# Altium schematic sheet WINGS_SIGNAL_SCH.SchDoc
size C; SheetNumber: 1; SheetTotal: 1
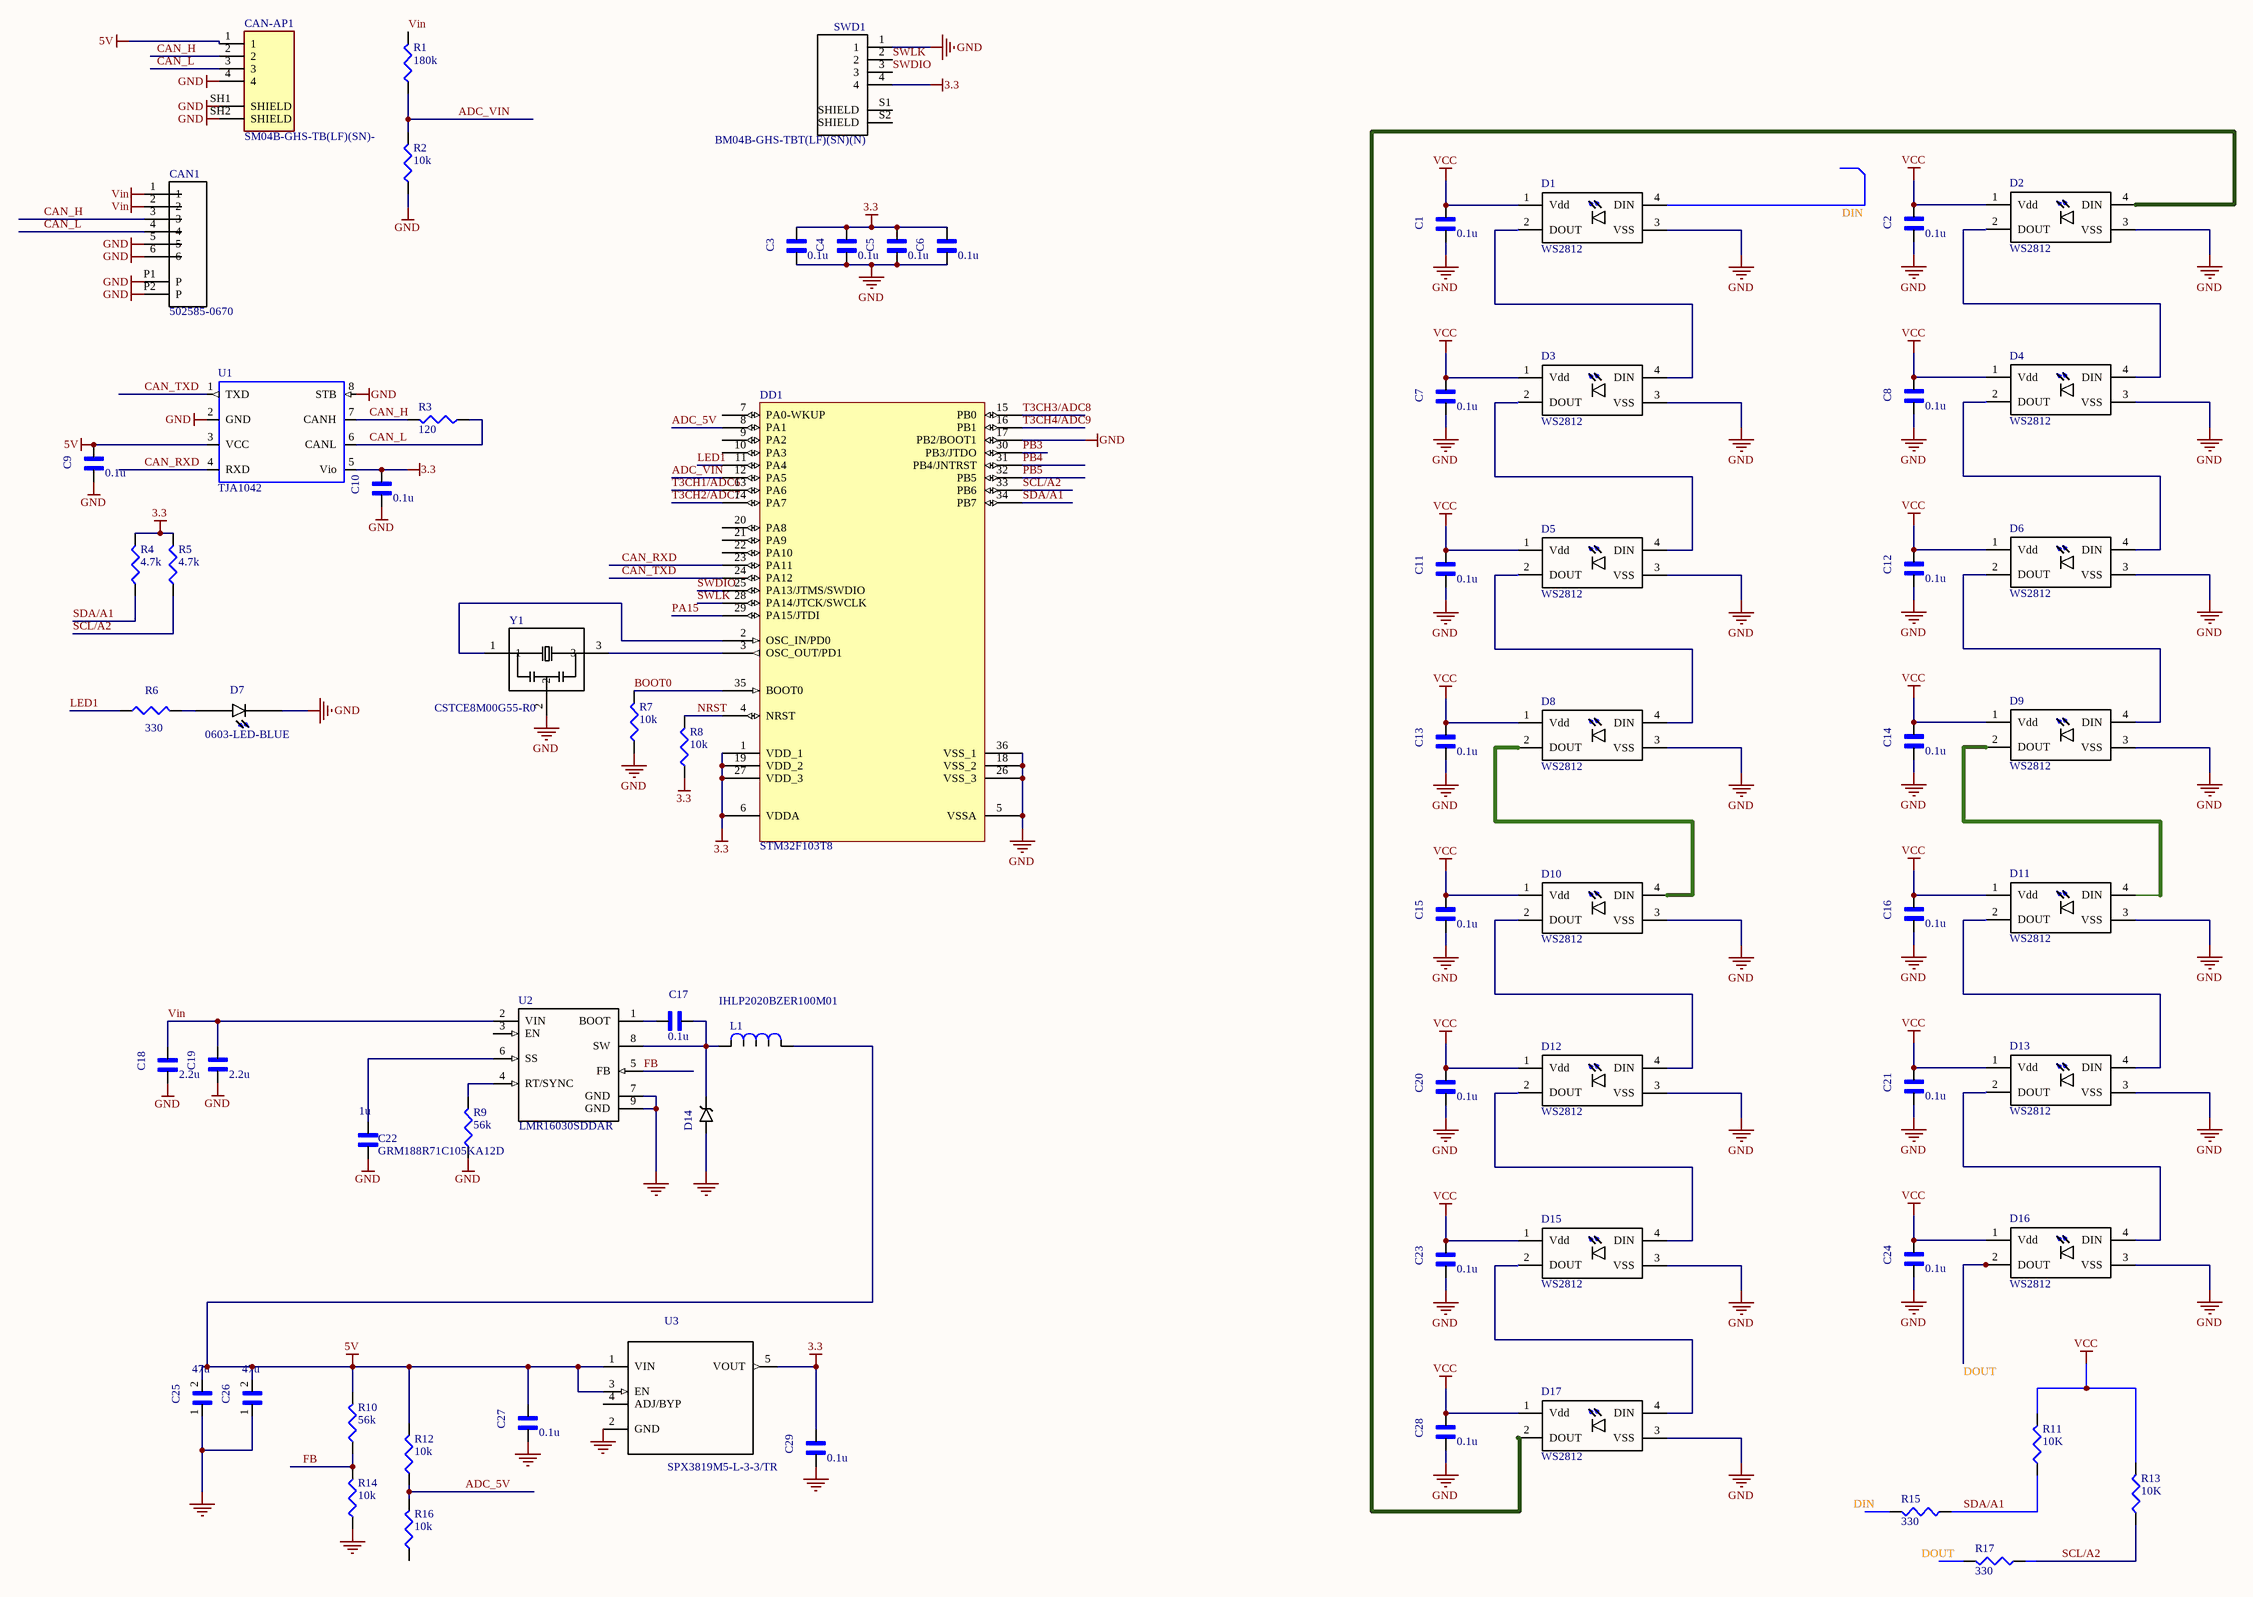
[diagram p0: WINGS_SIGNAL_SCH.SchDoc]

## Parts
C1  value 0.1u  [*CAPC1608X90]  (hidden comment: GX035C104MAT2-500)
C2  value 0.1u  [*CAPC1608X90]  (hidden comment: GX035C104MAT2-500)
C3  value 0.1u  [*CAPC1608X90]  (hidden comment: GX035C104MAT2-500)
C4  value 0.1u  [*CAPC1608X90]  (hidden comment: GX035C104MAT2-500)
C5  value 0.1u  [*CAPC1608X90]  (hidden comment: GX035C104MAT2-500)
C6  value 0.1u  [*CAPC1608X90]  (hidden comment: GX035C104MAT2-500)
C7  value 0.1u  [*CAPC1608X90]  (hidden comment: GX035C104MAT2-500)
C8  value 0.1u  [*CAPC1608X90]  (hidden comment: GX035C104MAT2-500)
C9  value 0.1u  [*CAPC1608X90]  (hidden comment: GX035C104MAT2-500)
C10  value 0.1u  [*CAPC1608X90]  (hidden comment: GX035C104MAT2-500)
C11  value 0.1u  [*CAPC1608X90]  (hidden comment: GX035C104MAT2-500)
C12  value 0.1u  [*CAPC1608X90]  (hidden comment: GX035C104MAT2-500)
C13  value 0.1u  [*CAPC1608X90]  (hidden comment: GX035C104MAT2-500)
C14  value 0.1u  [*CAPC1608X90]  (hidden comment: GX035C104MAT2-500)
C15  value 0.1u  [*CAPC1608X90]  (hidden comment: GX035C104MAT2-500)
C16  value 0.1u  [*CAPC1608X90]  (hidden comment: GX035C104MAT2-500)
C17  value 0.1u  [*CAPC1608X90]  (hidden comment: GX035C104MAT2-500)
C18  value 2.2u  [*CAP3216X125N]  (hidden comment: GRM31CR71H225KA88L)
C19  value 2.2u  [*CAP3216X125N]  (hidden comment: GRM31CR71H225KA88L)
C20  value 0.1u  [*CAPC1608X90]  (hidden comment: GX035C104MAT2-500)
C21  value 0.1u  [*CAPC1608X90]  (hidden comment: GX035C104MAT2-500)
C22  GRM188R71C105KA12D  value 1u  [CAPC1608X90N]
C23  value 0.1u  [*CAPC1608X90]  (hidden comment: GX035C104MAT2-500)
C24  value 0.1u  [*CAPC1608X90]  (hidden comment: GX035C104MAT2-500)
C25  value 47u  [*CAPC3216X125N]  (hidden comment: GRM31CR61A476KE15L)
C26  value 47u  [*CAPC3216X125N]  (hidden comment: GRM31CR61A476KE15L)
C27  value 0.1u  [*CAPC1608X90]  (hidden comment: GX035C104MAT2-500)
C28  value 0.1u  [*CAPC1608X90]  (hidden comment: GX035C104MAT2-500)
C29  value 0.1u  [*CAPC1608X90]  (hidden comment: GX035C104MAT2-500)
CAN1  502585-0670  [MOLEX_502585-0670]
CAN-AP1  SM04B-GHS-TB(LF)(SN)-  [JST_SM04B-GHS-TB(LF)(SN)-]
D1  WS2812  [LED_WS2812]
D2  WS2812  [LED_WS2812]
D3  WS2812  [LED_WS2812]
D4  WS2812  [LED_WS2812]
D5  WS2812  [LED_WS2812]
D6  WS2812  [LED_WS2812]
D7  0603-LED-BLUE  [*LEDM1608X80_LTE-C1906R-14(Primary)]
D8  WS2812  [LED_WS2812]
D9  WS2812  [LED_WS2812]
D10  WS2812  [LED_WS2812]
D11  WS2812  [LED_WS2812]
D12  WS2812  [LED_WS2812]
D13  WS2812  [LED_WS2812]
D14  SK56  [*SMB_P6SMB62AT3G(Primary)]  (value not drawn)
D15  WS2812  [LED_WS2812]
D16  WS2812  [LED_WS2812]
D17  WS2812  [LED_WS2812]
DD1  STM32F103T8  [*QFN50P600X600X100-37N]
L1  IHLP2020BZER100M01  [IHLP]
R1  value 180k  [J1-0603]  (hidden comment: Res3)
R2  value 10k  [J1-0603]  (hidden comment: Res3)
R3  value 120  [J1-0603]  (hidden comment: Res3)
R4  value 4.7k  [J1-0603]  (hidden comment: Res3)
R5  value 4.7k  [J1-0603]  (hidden comment: Res3)
R6  value 330  [J1-0603]  (hidden comment: Res3)
R7  value 10k  [J1-0603]  (hidden comment: RC0603FR-0710KL)
R8  value 10k  [J1-0603]  (hidden comment: RC0603FR-0710KL)
R9  value 56k  [J1-0603]  (hidden comment: Res3)
R10  value 56k  [J1-0603]  (hidden comment: Res3)
R11  value 10K  [J1-0603]  (hidden comment: Res3)
R12  value 10k  [J1-0603]  (hidden comment: RC0603FR-0710KL)
R13  value 10K  [J1-0603]  (hidden comment: Res3)
R14  value 10k  [J1-0603]  (hidden comment: RC0603FR-0710KL)
R15  value 330  [J1-0603]  (hidden comment: Res3)
R16  value 10k  [J1-0603]  (hidden comment: RC0603FR-0710KL)
R17  value 330  [J1-0603]  (hidden comment: Res3)
SWD1  BM04B-GHS-TBT(LF)(SN)(N)  [JST_BM04B-GHS-holes]
U1  TJA1042  [SOT782-1]
U2  LMR16030SDDAR  [*SOIC127P600X170-9N - duplicate]
U3  SPX3819M5-L-3-3/TR  [*SOT95P280X145-5N]
Y1  CSTCE8M00G55-R0  [*OSC_CSTCE8M00G55-R0]

## Nets
3.3: C3.1 C4.1 C5.1 C6.1 C10.1 C29.1 DD1.1(VDD_1) DD1.6(VDDA) DD1.19(VDD_2) DD1.27(VDD_3) R4.2 R5.2 R8.1 SWD1.4 U1.5(Vio) U3.5(VOUT)
5V: C9.1 C25.2 C26.2 C27.1 CAN-AP1.1 L1.1 R10.2 R12.2 U1.3(VCC) U3.1(VIN) U3.3(EN)
GND: C1.2 C2.2 C3.2 C4.2 C5.2 C6.2 C7.2 C8.2 C9.2 C10.2 C11.2 C12.2 C13.2 C14.2 C15.2 C16.2 C18.2 C19.2 C20.2 C21.2 C22.1 C23.2 C24.2 C25.1 C26.1 C27.2 C28.2 C29.2 CAN1.5 CAN1.6 CAN1.P1(P) CAN1.P2(P) CAN-AP1.4 CAN-AP1.SH1(SHIELD) CAN-AP1.SH2(SHIELD) D1.3(VSS) D2.3(VSS) D3.3(VSS) D4.3(VSS) D5.3(VSS) D6.3(VSS) D7.C D8.3(VSS) D9.3(VSS) D10.3(VSS) D11.3(VSS) D12.3(VSS) D13.3(VSS) D14.A D15.3(VSS) D16.3(VSS) D17.3(VSS) DD1.5(VSSA) DD1.17(PB2/BOOT1) DD1.18(VSS_2) DD1.26(VSS_3) DD1.36(VSS_1) R2.1 R7.1 R9.1 R14.1 SWD1.1 U1.2(GND) U1.8(STB) U2.7(GND) U2.9(GND) U3.2(GND) Y1.2
VCC: C1.1 C2.1 C7.1 C8.1 C11.1 C12.1 C13.1 C14.1 C15.1 C16.1 C20.1 C21.1 C23.1 C24.1 C28.1 D1.1(Vdd) D2.1(Vdd) D3.1(Vdd) D4.1(Vdd) D5.1(Vdd) D6.1(Vdd) D8.1(Vdd) D9.1(Vdd) D10.1(Vdd) D11.1(Vdd) D12.1(Vdd) D13.1(Vdd) D15.1(Vdd) D16.1(Vdd) D17.1(Vdd) R11.2 R13.2
Vin: C18.1 C19.1 CAN1.1 CAN1.2 R1.2 U2.2(VIN)
ADC_5V: DD1.8(PA1) R12.1 R16.2
ADC_VIN: DD1.12(PA5) R1.1 R2.2
BOOT0: DD1.35(BOOT0) R7.2
CAN_H: CAN1.3 CAN-AP1.2 R3.2 U1.7(CANH)
CAN_L: CAN1.4 CAN-AP1.3 R3.1 U1.6(CANL)
CAN_RXD: DD1.23(PA11) U1.4(RXD)
CAN_TXD: DD1.24(PA12) U1.1(TXD)
DIN: D1.4(DIN) R15.2
DOUT: D16.2(DOUT) R17.2
FB: R10.1 R14.2 U2.5(FB)
LED1: DD1.11(PA4) R6.1
NRST: DD1.4(NRST) R8.2
PA15: DD1.29(PA15/JTDI)
PB3: DD1.30(PB3/JTDO)
PB4: DD1.31(PB4/JNTRST)
PB5: DD1.32(PB5)
SCL/A2: DD1.33(PB6) R5.1 R13.1 R17.1
SDA/A1: DD1.34(PB7) R4.1 R11.1 R15.1
SWDIO: DD1.25(PA13/JTMS/SWDIO) SWD1.3
SWLK: DD1.28(PA14/JTCK/SWCLK) SWD1.2
T3CH1/ADC6: DD1.13(PA6)
T3CH2/ADC7: DD1.14(PA7)
T3CH3/ADC8: DD1.15(PB0)
T3CH4/ADC9: DD1.16(PB1)
NetC17_1: C17.1 D14.C L1.2 U2.8(SW)
NetC17_2: C17.2 U2.1(BOOT)
NetC22_2: C22.2 U2.6(SS)
NetD1_2: D1.2(DOUT) D3.4(DIN)
NetD2_2: D2.2(DOUT) D4.4(DIN)
NetD2_4: D2.4(DIN) D17.2(DOUT)
NetD3_2: D3.2(DOUT) D5.4(DIN)
NetD4_2: D4.2(DOUT) D6.4(DIN)
NetD5_2: D5.2(DOUT) D8.4(DIN)
NetD6_2: D6.2(DOUT) D9.4(DIN)
NetD7_A: D7.A R6.2
NetD8_2: D8.2(DOUT) D10.4(DIN)
NetD9_2: D9.2(DOUT) D11.4(DIN)
NetD10_2: D10.2(DOUT) D12.4(DIN)
NetD11_2: D11.2(DOUT) D13.4(DIN)
NetD12_2: D12.2(DOUT) D15.4(DIN)
NetD13_2: D13.2(DOUT) D16.4(DIN)
NetD15_2: D15.2(DOUT) D17.4(DIN)
NetDD1_2: DD1.2(OSC_IN/PD0) Y1.1
NetDD1_3: DD1.3(OSC_OUT/PD1) Y1.3
NetR9_2: R9.2 U2.4(RT/SYNC)

Not connected (* = marked no-connect by the designer): DD1 7(PA0-WKUP) 9(PA2) 10(PA3) 20(PA8) 21(PA9) 22(PA10); R16 1; SWD1 S1(SHIELD) S2(SHIELD); U2 3(EN); U3 4(ADJ/BYP)

## Library data of the parts
C1-C17 C20 C21 C23 C24 C28 = GX035C104MAT2-500: Cap Thin Film 0.1uf 50v 0603; MF: AVX; MP: GX035C104MAT2-500 or CL10B104JB8NNNC; Pacage Metric: 1608; Type: SMD; Package: 0603 AVX; SnapEDA_Link: https://www.snapeda.com/parts/GX035C104MAT2-500/AVX/view-part/?ref=snap
C18 C19 = GRM31CR71H225KA88L: / 1206 2.2 uF 50 V В±10% Tolerance X7R SMT Multilayer Ceramic Capacitor /; MF: Murata Electronics; Type: SMD; Package: 1206 Murata; SnapEDA_Link: https://www.snapeda.com/parts/GRM31CR71H225KA88L/Murata%20Electronics%20North%20America/view-part/?ref=snap; MP: GRM31CR71H225KA88L
C22 = GRM188R71C105KA12D: SMD Capacitor X7R(EIA) with Capacitance: 1.0uF Tol. 10%. Rated Voltage: 16Vdc; MF: Murata Electronics; Pacage Metric: 1608; MP: GRM188R71C105KA12D; SnapEDA_Link: https://www.snapeda.com/parts/GRM188R71C105KA12D/Murata%20Electronics%20North%20America/view-part/228340/?ref=snap; Package: 0603; ChipDip_Link: https://www.chipdip.ru/product/grm188r71c105ka12d; HelpURL: https://static.chipdip.ru/lib/428/DOC005428493.pdf; Type: SMD
C25 C26 = GRM31CR61A476KE15L: Multilayer Ceramic Capacitor, GRM Series, 47 - F, - 10%, X5R, 10 V, 1206 [3216 Metric]; MF: Murata Electronics; Type: SMD; Package: 1206 Murata Electronics; MP: GRM31CR61A476KE15L; SnapEDA_Link: https://www.snapeda.com/parts/GRM31CR61A476KE15L/Murata%20Electronics%20North%20America/view-part/?ref=snap
C27 C29 = GX035C104MAT2-500: Cap Thin Film 0.1uf 50v 0603; MF: AVX; Pacage Metric: 1608; Type: SMD; Package: 0603 AVX; MP: GX035C104MAT2-500; SnapEDA_Link: https://www.snapeda.com/parts/GX035C104MAT2-500/AVX/view-part/?ref=snap
CAN1 = 502585-0670: 1.50mm Pitch, CLIK-Mate PCB Receptacle, Single Row, Surface Mount, Right-Angle, Tin Plating, Positive Lock, 6 Circuits, Natural; MF: Molex; System: Connector; MP: 502585-0670; Package: None; SnapEDA_Link: https://www.snapeda.com/parts/502494-0670/Molex/view-part/?ref=snap; Value: *; Type: SMD
CAN-AP1 = SM04B-GHS-TB(LF)(SN)-: Connector Header Surface Mount, Right Angle 4 position 0.049 _1.25mm_; MF: JST Sales; MP: SM04B-GHS-TB(LF)(SN); Package: None; Value: *; SnapEDA_Link: https://www.snapeda.com/parts/SM04B-GHS-TB%28LF%29%28SN%29-/JST%20Sales%20America%20Inc./view-part/2759740/?ref=snap; HelpURL: http://www.farnell.com/datasheets/2082975.pdf; System: Connector; ChipDip_Link: https://www.chipdip.ru/product/sm04b-ghs-tb-lf-sn-gh-1.25mm-header-side-ent
D1-D6 D8-D13 D15-D17 = WS2812: Addressable Lighting - 5 LED Discrete Serial _Shift Register_ Red, Green, Blue _RGB_ 5.00mm Dia; MF: SparkFun Electronics; Availability: Unavailable; MP: WS2812; Price: None; Value: *; SnapEDA_Link: https://www.snapeda.com/parts/WS2812/SparkFun%20Electronics/view-part/106391/?ref=snap; Package: SparkFun Electronics; HelpURL: https://static.chipdip.ru/lib/554/DOC001554925.pdf; ChipDip_Link: https://www.chipdip.ru/product/ws2812b
D7 = LTE-C1906R-14: LED IrLED Chip LED 2-Pin SMD T/R; Package: 0603 Lite-On; MP: 0603-LED-BLUE; SnapEDA_Link: https://www.snapeda.com/parts/LTE-C1906R-14/Lite-On%20Inc./view-part/?ref=snap; Value: *; Type: SMD
D14 = SK56: Диод Шоттки 5А 60В [SMB / DO-214AA]; MF: Littelfuse Inc.; Type: SMD; MP: SK56; Package: DO-214 Littelfuse; SnapEDA_Link: https://www.snapeda.com/parts/P6SMB62AT3G/Littelfuse%20Inc./view-part/?ref=snap; Value: *; ChipDip_Link: https://www.chipdip.ru/product/sk56
DD1 = STM32F103T8: STM32F103T8U6, Микроконтроллер 32BIT ARM 64K FLASH [VFQFPN-36]; MF: STM; ChipDip_Link: https://www.chipdip.ru/product/stm32f103t8u6-2; HelpURL: http://www.st.com/stonline/products/literature/ds/13587.pdf; MP: STM32F103T8U6; Package: VFQFPN-36; SnapEDA_Link: https://www.snapeda.com/parts/STM32F103T8U6TR/STMicroelectronics/view-part/?ref=search&t=STM32F103T8U6; Type: SMD
L1 = IHLP2020BZER100M01: 10ÂµH Shielded Molded Inductor 2.3A 199mOhm Max Nonstandard; MF: Vishay Dale; Type: SMD; SnapEDA_Link: https://www.snapeda.com/parts/IHLP2020BZER100M01/Vishay%20Dale/view-part/44808/?ref=snap; MP: IHLP2020BZER100M01; Value: *; Package: Nonstandard Vishay; HelpURL: http://www.vishay.com/docs/34253/ihlp-2020bz-01.pdf; ChipDip_Link: https://www.chipdip.ru/product/ihlp2020bzer100m11-inductor-ihlp-smd-2020-10
R1 = Res3: Resistor; Pacage Metric: 1608; MP: 180K 1% 0603; Package: R0603; Type: SMD
R2 = Res3: Resistor; Pacage Metric: 1608; MP: 10K 1% 0603; ChipDip_Link: https://www.chipdip.ru/product0/9000079736; HelpURL: https://www.chipdip.ru/product0/9000079736; Package: R0603; Type: SMD
R3 = Res3: 120 Ohms 1 0.1 W 1 10 W Chip Resistor 0603 1608 Metric Thick Film; Pacage Metric: 1608; MP: RC0603FR-07120RL; ChipDip_Link: https://www.chipdip.ru/product0/9000079618; HelpURL: https://www.chipdip.ru/product0/9000079618; Package: R0603; Type: SMD
R4 R5 R11 R13 R15 R17 = Res3: Resistor; Pacage Metric: 1608; MP: 4.7K 1% 0603; ChipDip_Link: https://www.chipdip.ru/product0/9000079736; HelpURL: https://www.chipdip.ru/product0/9000079736; Package: R0603; Type: SMD
R6 = Res3: Resistor; Pacage Metric: 1608; MP: RC0603FR-07330RL; ChipDip_Link: https://www.chipdip.ru/product0/9000079628; HelpURL: https://www.chipdip.ru/product0/9000079628; Package: R0603; Type: SMD
R7 R8 R12 R14 R16 = RC0603FR-0710KL: 10 kOhms 1 0.1 W 1 10 W Chip Resistor 0603 1608 Metric Thick Film; Pacage Metric: 1608; MF: Yageo or NXP; MP: 10K 1% 0603; ChipDip_Link: https://www.chipdip.ru/product0/9000079736; HelpURL: https://www.chipdip.ru/product0/9000079736; Package: R0603; Type: SMD; SnapEDA_Link: https://www.snapeda.com/parts/RC0603FR-0710KL/Yageo/view-part/?ref=dk&t=RC0603FR-0710KL&con_ref=None
R9 R10 = Res3: Resistor; Pacage Metric: 1608; MP: RC0603FR-0756KL; ChipDip_Link: https://www.chipdip.ru/product0/9000079754; HelpURL: https://www.chipdip.ru/product0/9000079754; Package: R0603; Type: SMD
SWD1 = BM04B-GHS-TBT(LF)(SN)(N): Conn Shrouded Header HDR 4 POS 1.25mm Solder ST SMD Reel; MF: JST Sales; MP: SM04B-GHS-TB(LF)(SN); Instructions: Do not install; System: Connector; SnapEDA_Link: https://www.snapeda.com/parts/BM04B-GHS-TBT%28LF%29%28SN%29%28N%29/JST%20Sales%20America%20Inc./view-part/?ref=snap; Package: None; Value: *; Type: SMD
U1 = TJA1042: 1/1 Transceiver Half CANbus 8-SO; MF: NXP USA; SnapEDA_Link: https://www.snapeda.com/parts/TJA1042/NXP%20USA%20Inc./view-part/900919/?ref=snap; Value: *; MP: TJA1042; Package: VDFN-8 NXP USA; ChipDip_Link: https://www.chipdip.ru/product1/8002840332; HelpURL: https://static.chipdip.ru/lib/583/DOC001583059.pdf; Type: SMD
U2 = LMR16030SDDAR: LMR16030SDDAR, Conv DC-DC 4.3V to 60V Step Down Single-Out 1V to 50V 3A Automotive 8-Pin HSOP EP T/R; MF: Texas Instruments; SnapEDA_Link: https://www.snapeda.com/parts/TPS54560DDA/Texas%20Instruments/view-part/?ref=snap; MP: LMR16030SDDAR; Package: PowerSOIC-8 Texas Instruments; Value: *; Type: SMD; ChipDip_Link: https://www.chipdip.ru/product1/8003448566; HelpURL: https://www.ti.com/lit/ds/symlink/lmr16030.pdf
U3 = SPX3819M5-L: Low Dropout Voltage Regulator, Adjustable 0.5A, В±1%, 2.5 to 16 Vin, 5-Pin SOT-23 /; MF: MaxLinear, Inc.; Value: 3V3; MP: SPX3819M5-L-3-3/TR; Package: SOT-23-5 Exar; SnapEDA_Link: https://www.snapeda.com/parts/SPX3819M5-L/MaxLinear%2C%20Inc./view-part/?ref=snap; Type: SMD; ChipDip_Link: https://www.chipdip.ru/product1/8003455237; HelpURL: http://www.farnell.com/datasheets/2614478.pdf
Y1 = CSTCE8M00G55-R0: Ceramic Resonator 8MHz ??0.5% _Tol_ ??0.2% _Stability_ 33pF 40Ohm 3-Pin CSMD T/R; MF: Murata; MP: CSTCE8M00G55-R0; Package: SMD-3 Murata; SnapEDA_Link: https://www.snapeda.com/parts/CSTCE8M00G55-R0/Murata%20Electronics%20North%20America/view-part/?ref=snap; Value: *; ChipDip_Link: https://www.chipdip.ru/product1/8001783721; HelpURL: https://www.murata.com/en-eu/api/pdfdownloadapi?cate=&partno=CSTCE8M00G55-R0; Type: SMD